# EAGLE design EnhancedMorseDecoder_Board (EAGLE 5.11)
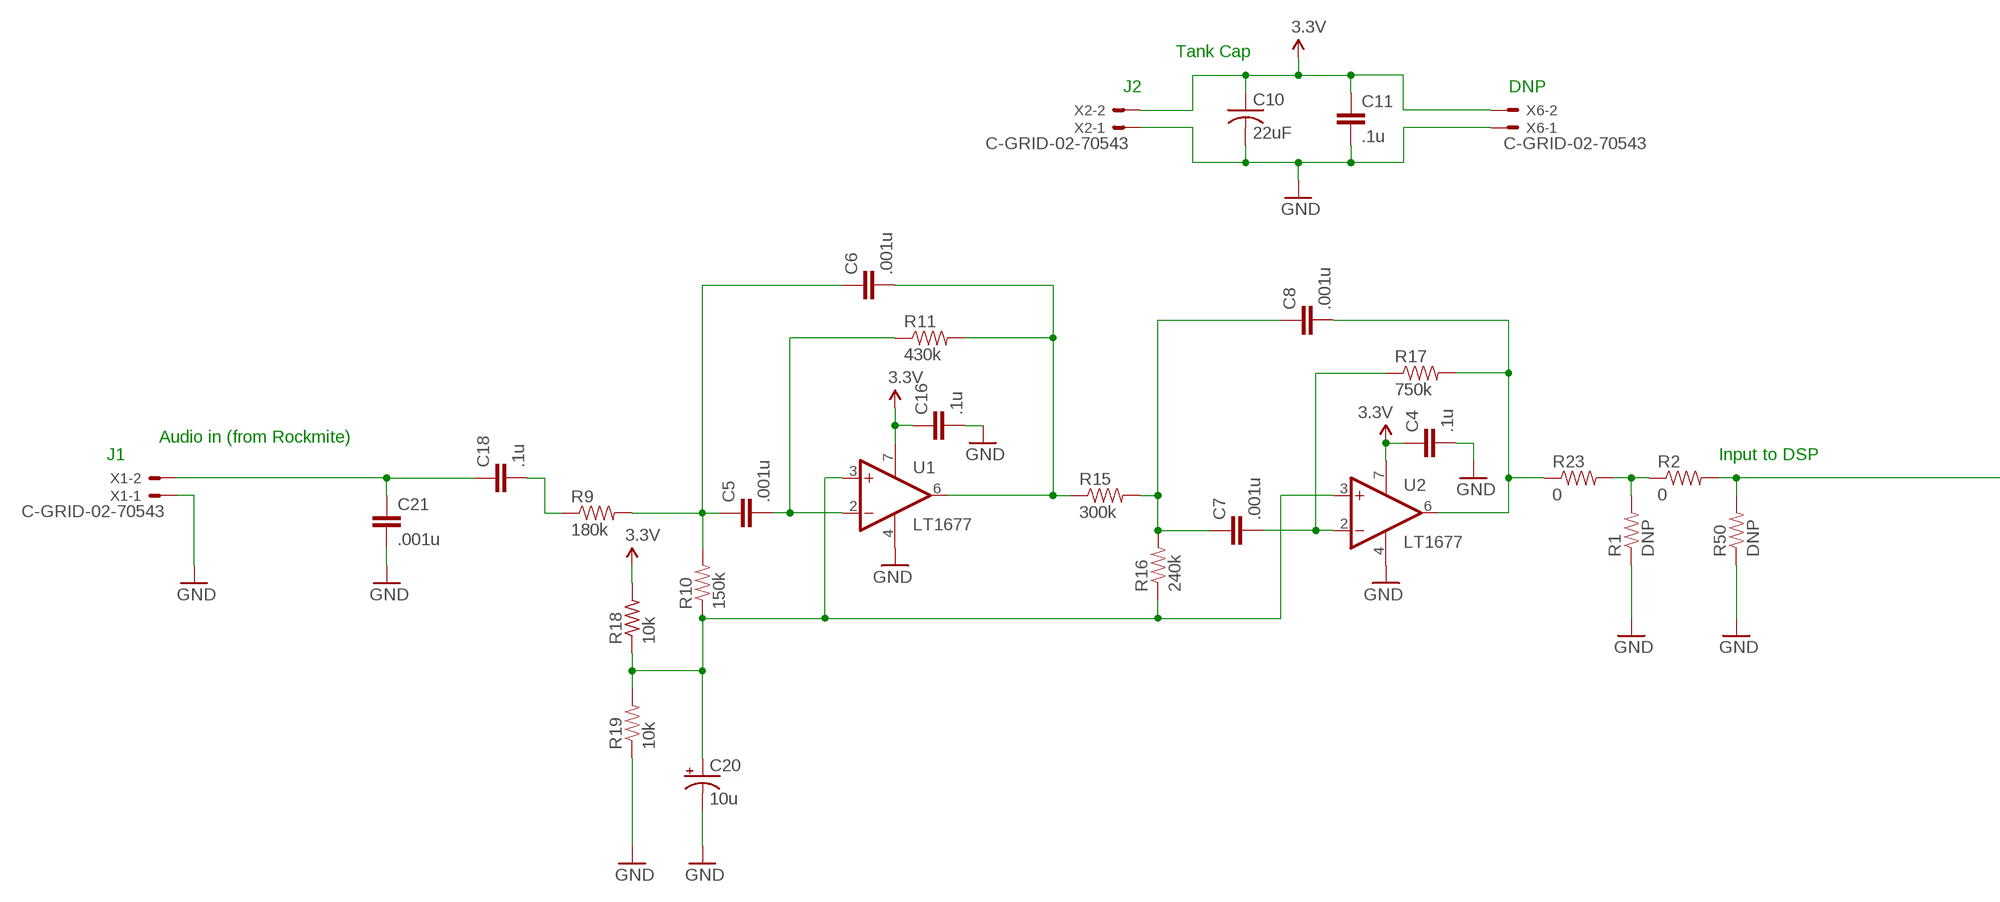
[diagram p0: schematic, sheet 1, part 1 of 2]
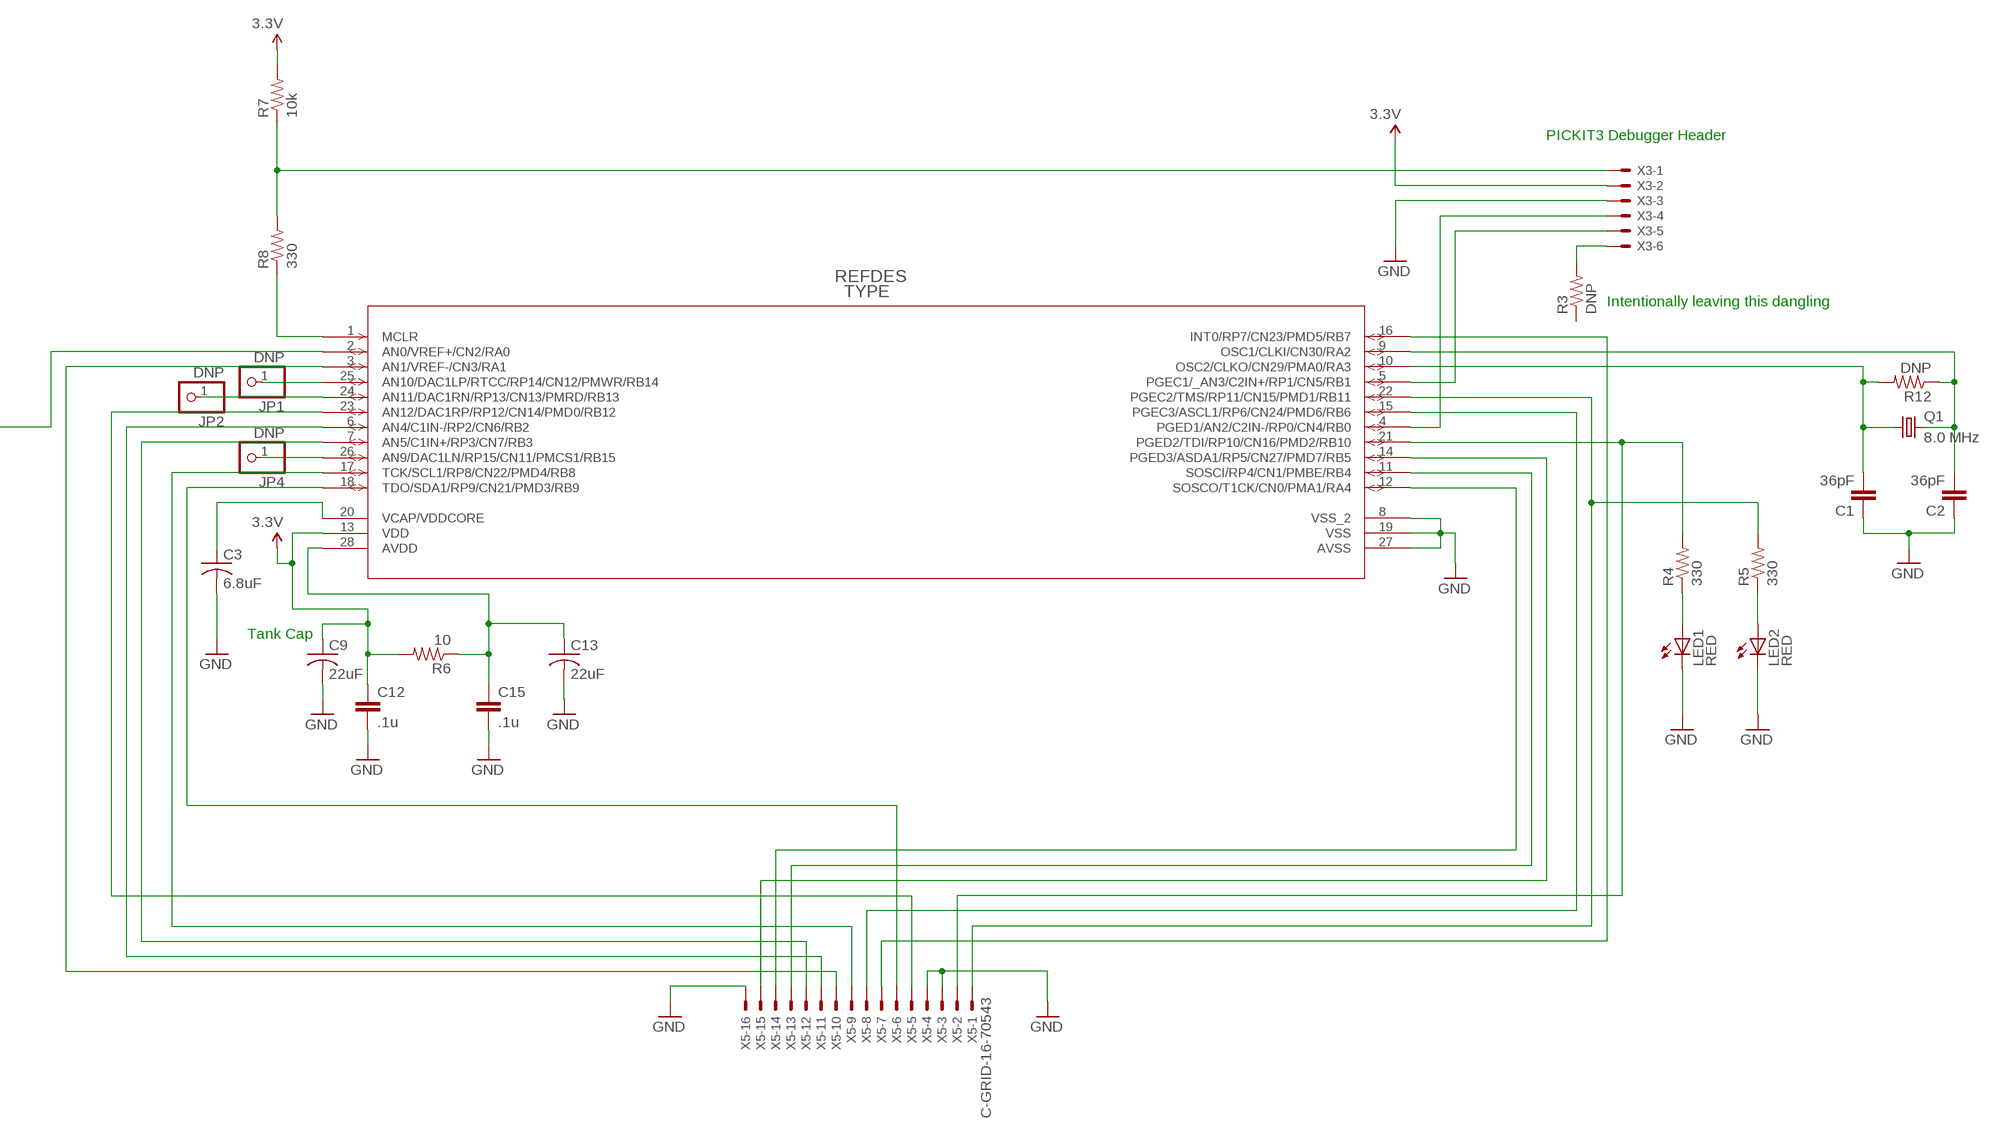
[diagram p1: schematic, sheet 1, part 2 of 2]

## Parts
C1  36pF  CAP0603-CAP  [0603-CAP]
C2  36pF  CAP0603-CAP  [0603-CAP]
C3  6.8uF  C-USC1206  [C1206]
C4  .1u  CAP1210  [1210]
C5  .001u  CAP0805  [0805]
C6  .001u  CAP0805  [0805]
C7  .001u  CAP0805  [0805]
C8  .001u  CAP0805  [0805]
C9  22uF  C-USC1210  [C1210]
C10  22uF  C-USC1210  [C1210]
C11  .1u  CAP1210  [1210]
C12  .1u  CAP1210  [1210]
C13  22uF  C-USC1210  [C1210]
C15  .1u  CAP1210  [1210]
C16  .1u  CAP1210  [1210]
C18  .1u  CAP1210  [1210]
C20  10u  CAP_POL7343  [EIA7343]
C21  .001u  CAP0805  [0805]
DSPIC  DSPIC33FJ128GP80  [SOIC28_W_MC]
JP1  DNP  PINHD-1X1  [1X01]
JP2  DNP  PINHD-1X1  [1X01]
JP4  DNP  PINHD-1X1  [1X01]
LED1  RED  LEDCHIPLED_0805  [CHIPLED_0805]
LED2  RED  LEDCHIPLED_0805  [CHIPLED_0805]
Q1  8.0 MHz  CRYSTALHC49S  [HC49/S]
R1  DNP  RESISTOR  [0805]
R2  0  RESISTOR  [0805]
R3  DNP  RESISTOR  [0805]
R4  330  R-US_R0603  [R0603]
R5  330  R-US_R0603  [R0603]
R6  10  R-US_R0805  [R0805]
R7  10k  R-US_R0603  [R0603]
R8  330  R-US_R0603  [R0603]
R9  180k  RESISTOR  [0805]
R10  150k  RESISTOR1206  [1206]
R11  430k  RESISTOR1206  [1206]
R12  DNP  RESISTOR  [0805]
R15  300k  RESISTOR1206  [1206]
R16  240k  RESISTOR1206  [1206]
R17  750k  RESISTOR1206  [1206]
R18  10k  R-US_R0603  [R0603]
R19  10k  RESISTOR0603-RES  [0603-RES]
R23  0  RESISTOR  [0805]
R50  DNP  RESISTOR  [0805]
U1  LT1677  LM307D  [SO08]
U2  LT1677  LM307D  [SO08]
X1  C-GRID-02-70543  [70543-02]
X2  C-GRID-02-70543  [70543-02]
X3  22-23-2061  [22-23-2061]
X5  C-GRID-16-70543  [70543-16]
X6  C-GRID-02-70543  [70543-02]

## Nets
3.3V: C4.1 C9.1 C10.1 C11.1 C12.1 C16.1 DSPIC.13(VDD) R6.2 R7.2 R18.2 U1.7(V+) U2.7(V+) X2.2 X3.2 X6.2
GND: C1.1 C2.1 C3.2 C4.2 C9.2 C10.2 C11.2 C12.2 C13.2 C15.2 C16.2 C20.C(-) C21.2 DSPIC.8(VSS_2) DSPIC.19(VSS) DSPIC.27(AVSS) LED1.C LED2.C R1.1 R19.1 R50.1 U1.4(V-) U2.4(V-) X1.1 X2.1 X3.3 X5.3 X5.4 X5.16 X6.1
N$1: R1.2 R2.1 R23.2
N$2: C1.2 DSPIC.10(OSC2/CLKO/CN29/PMA0/RA3) Q1.1 R12.2
N$3: C18.2 R9.1
N$4: C5.1 C6.1 R9.2 R10.2
N$5: C20.A(+) R10.1 R16.1 R18.1 R19.2 U1.3(+IN) U2.3(+IN)
N$6: DSPIC.25(AN10/DAC1LP/RTCC/RP14/CN12/PMWR/RB14) JP1.1
N$7: C6.2 R11.2 R15.1 U1.6(OUT)
N$8: C18.1 C21.1 X1.2
N$9: C7.1 C8.1 R15.2 R16.2
N$10: C7.2 R17.1 U2.2(-IN)
N$11: C8.2 R17.2 R23.1 U2.6(OUT)
N$12: C13.1 C15.1 DSPIC.28(AVDD) R6.1
N$13: DSPIC.3(AN1/VREF-/CN3/RA1) X5.10
N$14: DSPIC.2(AN0/VREF+/CN2/RA0) R2.2 R50.2
N$15: C5.2 R11.1 U1.2(-IN)
N$16: DSPIC.4(PGED1/AN2/C2IN-/RP0/CN4/RB0) X3.4
N$17: DSPIC.5(PGEC1/_AN3/C2IN+/RP1/CN5/RB1) X3.5
N$18: R3.2 X3.6
N$19: DSPIC.24(AN11/DAC1RN/RP13/CN13/PMRD/RB13) JP2.1
N$20: DSPIC.23(AN12/DAC1RP/RP12/CN14/PMD0/RB12) X5.5
N$21: DSPIC.26(AN9/DAC1LN/RP15/CN11/PMCS1/RB15) JP4.1
N$22: C2.2 DSPIC.9(OSC1/CLKI/CN30/RA2) Q1.2 R12.1
N$23: DSPIC.21(PGED2/TDI/RP10/CN16/PMD2/RB10) R4.2 X5.2
N$26: DSPIC.17(TCK/SCL1/RP8/CN22/PMD4/RB8) X5.9
N$27: DSPIC.18(TDO/SDA1/RP9/CN21/PMD3/RB9) X5.6
N$28: DSPIC.16(INT0/RP7/CN23/PMD5/RB7) X5.7
N$29: DSPIC.22(PGEC2/TMS/RP11/CN15/PMD1/RB11) R5.2 X5.1
N$30: DSPIC.15(PGEC3/ASCL1/RP6/CN24/PMD6/RB6) X5.8
N$32: DSPIC.14(PGED3/ASDA1/RP5/CN27/PMD7/RB5) X5.15
N$33: DSPIC.11(SOSCI/RP4/CN1/PMBE/RB4) X5.13
N$34: DSPIC.1(MCLR) R8.1
N$35: LED1.A R4.1
N$37: LED2.A R5.1
N$38: DSPIC.12(SOSCO/T1CK/CN0/PMA1/RA4) X5.14
N$39: C3.1 DSPIC.20(VCAP/VDDCORE)
N$40: R7.1 R8.2 X3.1
N$41: DSPIC.6(AN4/C1IN-/RP2/CN6/RB2) X5.11
N$42: DSPIC.7(AN5/C1IN+/RP3/CN7/RB3) X5.12
Unconnected: R3.1

## Notes on the sheet
- Tank Cap
- J2 | DNP
- PICKIT3 Debugger Header
- Intentionally leaving this dangling
- Audio in (from Rockmite)
- J1 | Input to DSP
- Tank Cap

## Library data of the parts
C1 C2 C4-C8 C11 C12 C15 C16 C18 C21 = SparkFun:CAP: Capacitor Standard 0603 ceramic capacitor, and 0.1" leaded capacitor.
C3 C9 C10 C13 = rcl:C-US: CAPACITOR, American symbol
C20 = SparkFun:CAP_POL: Capacitor Polarized These are standard SMD and PTH capacitors. Normally 10uF, 47uF, and 100uF in electrolytic and tantalum varieties. Always verify the external diameter of the through hole cap, it varies with capacity, voltage, and manufacturer. The EIA devices should be standard.
DSPIC = DSPIC33FJ128GPS80:DSPIC33FJ128GP80
JP1 JP2 JP4 = pinhead:PINHD-1X1: PIN HEADER
LED1 LED2 = led:LED: LED OSRAM: - CHIPLED LG R971, LG N971, LY N971, LG Q971, LY Q971, LO R971, LY R971 LH N974, LH R974 LS Q976, LO Q976, LY Q976 LO Q996 - Hyper CHIPLED LW Q18S LB Q993, LB Q99A, LB R99A - SideLED LS A670, LO A670, LY A670, LG A670, LP A670 LB A673, LV A673, LT A673, LW A673 LH A674 LY A675 LS A676, LA A676, LO A676, LY A676, LW A676 LS A679, LY A679, LG A679 - Hyper Micro SIDELED® LS Y876, LA Y876, LO Y876, LY Y876 LT Y87S - SmartLED LW L88C, LW L88S LB L89C, LB L89S, LG L890 LS L89K, LO L89K, LY L89K LS L896, LA L896, LO L896, LY L896 - TOPLED LS T670, LO T670, LY T670, LG T670, LP T670 LSG T670, LSP T670, LSY T670, LOP T670, LYG T670 LG T671, LOG T671, LSG T671 LB T673, LV T673, LT T673, LW T673 LH T674 LS T676, LA T676, LO T676, LY T676, LB T676, LH T676, LSB T676, LW T676 LB T67C, LV T67C, LT T67C, LS T67K, LO T67K, LY T67K, LW E67C LS E67B, LA E67B, LO E67B, LY E67B, LB E67C, LV E67C, LT E67C LW T67C LS T679, LY T679, LG T679 LS T770, LO T770, LY T770, LG T770, LP T770 LB T773, LV T773, LT T773, LW T773 LH T774 LS E675, LA E675, LY E675, LS T675 LS T776, LA T776, LO T776, LY T776, LB T776 LHGB T686 LT T68C, LB T68C - Hyper Mini TOPLED® LB M676 - Mini TOPLED Santana® LG M470 LS M47K, LO M47K, LY M47K Source: http://www.osram.convergy.de LUXEON: - LUMILED® LXK2-PW12-R00, LXK2-PW12-S00, LXK2-PW14-U00, LXK2-PW14-V00 LXK2-PM12-R00, LXK2-PM12-S00, LXK2-PM14-U00 LXK2-PE12-Q00, LXK2-PE12-R00, LXK2-PE12-S00, LXK2-PE14-T00, LXK2-PE14-U00 LXK2-PB12-K00, LXK2-PB12-L00, LXK2-PB12-M00, LXK2-PB14-N00, LXK2-PB14-P00, LXK2-PB14-Q00 LXK2-PR12-L00, LXK2-PR12-M00, LXK2-PR14-Q00, LXK2-PR14-R00 LXK2-PD12-Q00, LXK2-PD12-R00, LXK2-PD12-S00 LXK2-PH12-R00, LXK2-PH12-S00 LXK2-PL12-P00, LXK2-PL12-Q00, LXK2-PL12-R00 Source: www.luxeon.com KINGBRIGHT: KA-3528ASYC Source: www.kingbright.com
Q1 = crystal:CRYSTAL: CRYSTAL; OC_FARNELL: 1667008; OC_NEWARK: unknown
R1-R3 R9-R12 R15-R17 R19 R23 R50 = SparkFun:RESISTOR: Resistor Basic schematic elements and footprints for 0603, 1206, and PTH 1/10th watt (small) resistors.
R4-R8 R18 = rcl:R-US_: RESISTOR, American symbol
U1 U2 = linear:LM307: OP AMP
X1 X2 X6 = con-molex:C-GRID-02: CONNECTOR wire to board 2.54 mm (0.100") pitch header; OC_FARNELL: unknown; OC_NEWARK: unknown
X3 = con-molex:22-23-2061: .100" (2.54mm) Center Header - 6 Pin; MF: MOLEX; MPN: 22-23-2061; OC_FARNELL: 1462922; OC_NEWARK: 27C1933
X5 = con-molex:C-GRID-16: CONNECTOR wire to board 2.54 mm (0.100") pitch header; OC_FARNELL: unknown; OC_NEWARK: unknown

## Board
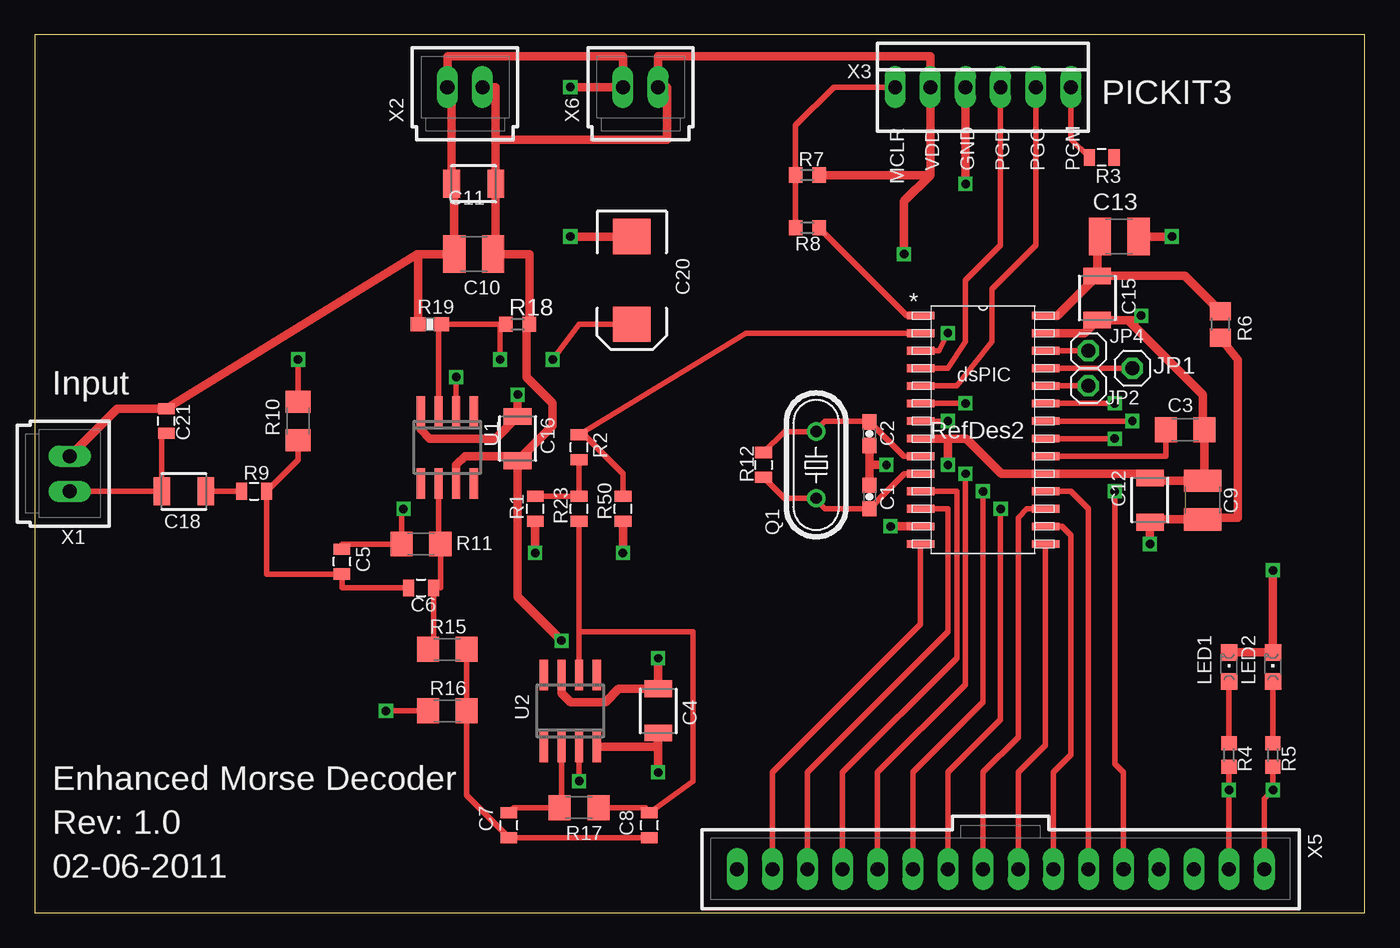
[diagram p2: board, top side]
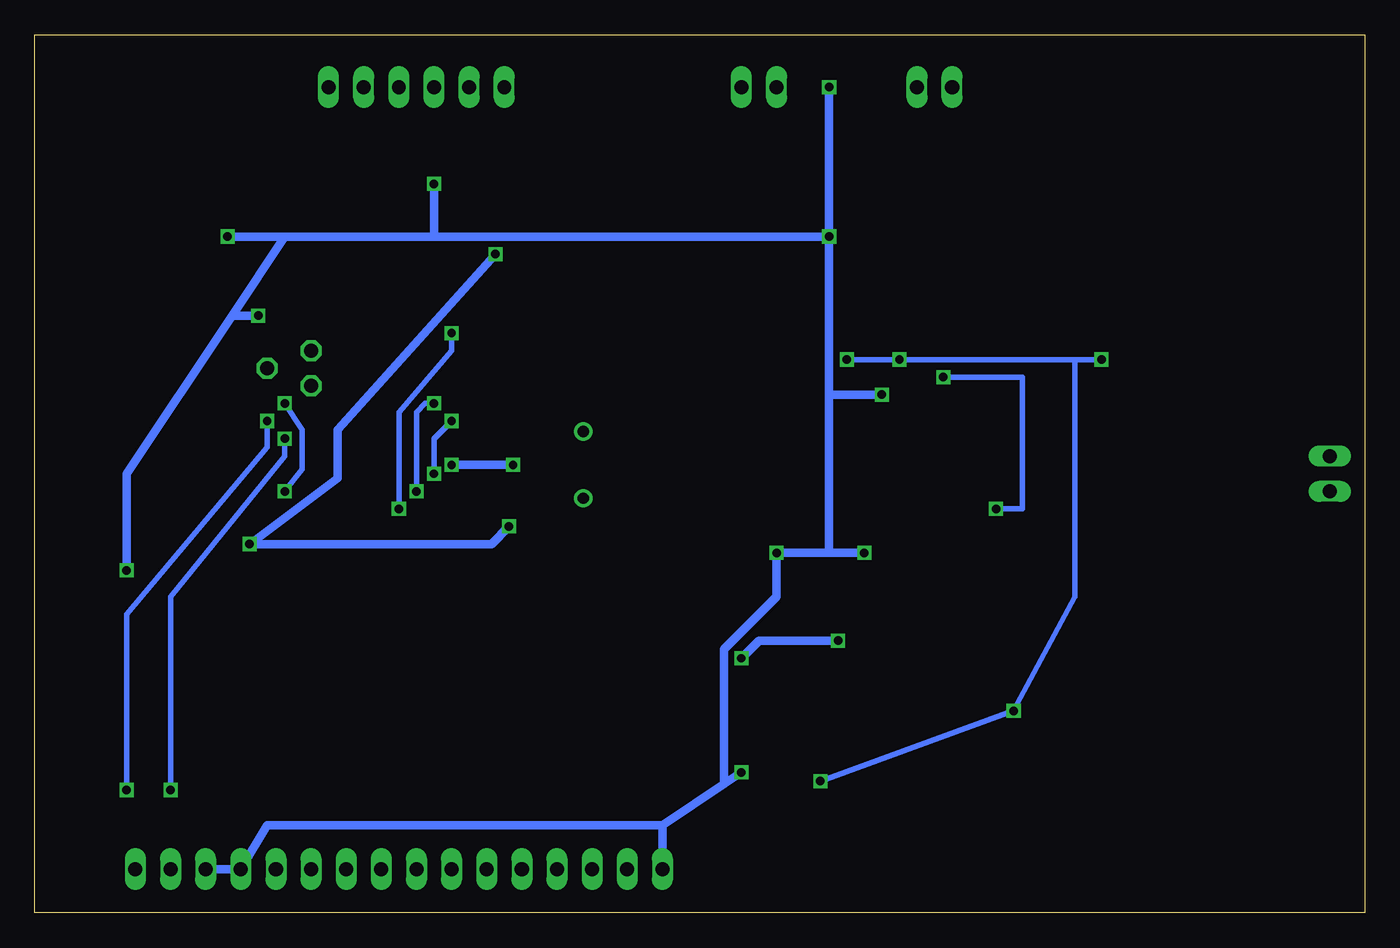
[diagram p3: board, bottom side, seen from below]

Size 96.19 x 63.49 mm. Coordinates in mm from the lower left corner, seen from the top.
Outline: 0,0 96.19,0 96.19,63.49 0,63.49 0,0
Copper layers (1*16): Top 0.035mm / dielectric 1.5mm / Bottom 0.035mm
Design rules "default": minimum track width 10mil, minimum drill 24mil, track to track 8mil, track to pad 8mil, pad to pad 8mil, via to via 8mil, smd to smd 8mil, copper to edge 40mil, drill to drill 8mil, minimum pad ring 10mil, minimum via ring 8mil, stop-mask expansion 4mil, vias tented up to drill 0mil, thermal gap 10mil

### Footprints (pad centres in the part's own frame; a part is rotated, then mirrored left to right if it is on the bottom)
0603-CAP = smd 1.1 x 1: 1 -0.85,0; 2 0.85,0
C1206 = smd 1.6 x 1.8: 1 -1.4,0; 2 1.4,0
1210 = smd 1.2 x 2: 1 -1.6,0; 2 1.6,0
0805 = smd 0.8 x 1.2: 1 -0.9,0; 2 0.9,0
C1210 = smd 1.6 x 2.7: 1 -1.4,0; 2 1.4,0
EIA7343 = smd 2.55 x 2.7: A 3.17,0; C -3.17,0
SOIC28_W_MC = smd 1.981 x 0.559: 1 -4.521,8.255; 2 -4.521,6.985; 3 -4.521,5.715; 4 -4.521,4.445; 5 -4.521,3.175; 6 -4.521,1.905; 7 -4.521,0.635; 8 -4.521,-0.635; 9 -4.521,-1.905; 10 -4.521,-3.175; 11 -4.521,-4.445; 12 -4.521,-5.715; 13 -4.521,-6.985; 14 -4.521,-8.255; 15 4.521,-8.255; 16 4.521,-6.985; 17 4.521,-5.715; 18 4.521,-4.445; 19 4.521,-3.175; 20 4.521,-1.905; 21 4.521,-0.635; 22 4.521,0.635; 23 4.521,1.905; 24 4.521,3.175; 25 4.521,4.445; 26 4.521,5.715; 27 4.521,6.985; 28 4.521,8.255
1X01 = drill 1.016 octagon: 1 0,0
CHIPLED_0805 = smd 1.2 x 1.2: A 0,-1.05; C 0,1.05
HC49/S = drill 0.813 round: 1 -2.413,0; 2 2.413,0
R0603 = smd 1 x 1.1: 1 -0.85,0; 2 0.85,0
R0805 = smd 1.3 x 1.5: 1 -0.95,0; 2 0.95,0
1206 = smd 1.6 x 1.8: 1 -1.4,0; 2 1.4,0
0603-RES = smd 1.1 x 1: 1 -0.85,0; 2 0.85,0
SO08 = smd 0.6 x 2.2: 1 -1.905,-2.6; 2 -0.635,-2.6; 3 0.635,-2.6; 4 1.905,-2.6; 5 1.905,2.6; 6 0.635,2.6; 7 -0.635,2.6; 8 -1.905,2.6
70543-02 = drill 1.016 long: 1 -1.27,0; 2 1.27,0
22-23-2061 = drill 1 long: 1 -6.35,0; 2 -3.81,0; 3 -1.27,0; 4 1.27,0; 5 3.81,0; 6 6.35,0
70543-16 = drill 1.016 long: 1 -19.05,0; 2 -16.51,0; 3 -13.97,0; 4 -11.43,0; 5 -8.89,0; 6 -6.35,0; 7 -3.81,0; 8 -1.27,0; 9 1.27,0; 10 3.81,0; 11 6.35,0; 12 8.89,0; 13 11.43,0; 14 13.97,0; 15 16.51,0; 16 19.05,0

### Placement (x,y rotation side)
C1  60.38,30.07 270 top
C2  60.38,34.65 90 top
C3  83.19,34.92 0 top
C4  45.09,14.61 270 top
C5  22.23,25.4 90 top
C6  27.94,23.5 0 top
C7  34.29,6.35 90 top
C8  44.45,6.35 90 top
C9  84.45,29.84 90 top
C10  31.75,47.62 180 top
C11  31.75,52.7 180 top
C12  80.64,29.84 90 top
C13  78.42,48.9 0 top
C15  76.83,44.45 270 top
C16  34.92,34.29 90 top
C18  10.79,30.48 0 top
C20  43.18,45.72 270 top
C21  9.53,35.56 90 top
DSPIC  68.58,34.92 0 top
JP1  79.38,39.37 0 top
JP2  76.2,38.1 0 top
JP4  76.2,40.64 0 top
LED1  86.36,17.78 0 top
LED2  89.53,17.78 0 top
Q1  56.52,32.38 90 top
R1  36.2,29.21 90 top
R2  39.37,33.66 90 top
R3  77.15,54.61 180 top
R4  86.36,11.43 270 top
R5  89.53,11.43 270 top
R6  85.72,42.55 270 top
R7  55.88,53.34 0 top
R8  55.88,49.53 180 top
R9  15.88,30.48 0 top
R10  19.05,35.56 270 top
R11  27.94,26.67 0 top
R12  52.7,32.38 270 top
R15  29.84,19.05 0 top
R16  29.84,14.61 0 top
R17  39.37,7.62 0 top
R18  34.92,42.55 0 top
R19  28.57,42.55 0 top
R23  39.37,29.21 90 top
R50  42.55,29.21 90 top
U1  29.84,33.66 180 top
U2  38.73,14.61 0 top
X1  2.54,31.75 270 top
X2  31.11,59.69 0 top
X3  68.58,59.69 0 top
X5  69.85,3.17 180 top
X6  43.81,59.69 0 top

### Tracks (layer width: path | path; a pad name or v marks a point on that pad's centre or on a via)
3.3V  (via drill 0.61)
  Top 0.406: 33.35,47.62 C10.1 | C9.1 83.82,28.57 | C12.1 80.64,28.45 | 35.56,42.55 R18.2
  Top 0.61: X2.2 33.35,59.69 33.35,55.88 | 33.35,55.88 C11.1 33.35,47.62 35.77,47.62 R18.2 | 33.35,55.88 45.72,55.88 45.72,59.69 X6.2 45.09,61.91 64.77,61.91 X3.2 64.77,53.34 | 83.82,28.57 87,28.57 87,40.01 R6.2 | 80.64,28.45 C9.1 | v80.64,26.67 C12.1 | 64.77,53.34 R7.2 | 35.56,42.55 35.56,38.73 37.47,36.83 37.47,35.23 C16.1 | v61.89,27.94 DSPIC.13 | 64.77,53.34 62.87,51.44 v62.87,47.62 | U1.7 30.48,32.38 31.11,33.02 34.92,33.02 C16.1 | C16.1 34.92,22.86 v38.1,19.68 | v45.09,18.41 C4.1 42.24,16.2 41.27,15.24 38.73,15.24 38.1,15.88 U2.7
  Bottom 0.61: v62.87,47.62 74.3,34.92 74.3,31.43 v80.64,26.67 63.16,26.67 v61.89,27.94 | v38.1,19.68 43.81,19.68 v45.09,18.41
GND  (via drill 0.61)
  Top 0.406: 30.15,59.69 X2.1 | 30.35,52.7 C11.2 | 80.64,31.25 C12.2 80.36,31.75 | 27.68,47.62 C10.2 | C20.C | C4.2 45.09,12.01 | 84.45,35.05 C3.2 | 84.58,31.38 C9.2
  Top 0.61: X2.1 29.84,61.91 42.55,61.91 X6.1 v38.73,59.69 | C11.2 30.15,59.69 | 30.35,52.7 C10.2 27.73,47.62 R19.1 | C9.2 80.64,31.25 | 80.36,31.75 DSPIC.19 69.9,31.75 67.36,34.29 66.04,34.29 | X1.1 5.98,36.46 C21.2 27.68,47.62 | v38.73,48.9 C20.C | 45.09,12.01 U2.4 | v42.55,26.04 R50.1 | v45.09,10.16 C4.2 | 66.04,34.29 DSPIC.8 | U1.4 27.94,34.92 28.57,34.29 33.33,34.29 C16.2 v34.92,37.47 | v36.2,26.04 R1.1 | LED1.C LED2.C v89.53,24.77 | v67.31,52.7 X3.3 | v80.01,43.18 79.68,42.85 C15.2 | C15.2 75.89,41.91 DSPIC.27 | C1.1 C2.1 60.38,32.38 v61.59,32.38 | 66.04,34.29 v66.04,32.38 | C15.2 79.07,42.85 84.45,37.47 84.45,35.05 | C3.2 84.58,31.38 | v82.23,48.9 C13.2
  Bottom 0.406: 46.35,9.48 46.26,9.38
  Bottom 0.61: v38.73,59.69 v38.73,48.9 | v45.09,10.16 46.26,9.38 50.8,6.35 | 50.8,6.35 X5.16 | 38.73,26.04 v42.55,26.04 42.55,22.86 46.35,19.05 46.35,9.48 | 38.73,26.04 v36.2,26.04 | v38.73,48.9 38.73,37.47 | 38.73,37.47 38.73,26.04 | 38.73,37.47 v34.92,37.47 | v38.73,48.9 67.31,48.9 | 67.31,48.9 v67.31,52.7 | 67.31,48.9 78.11,48.9 | 78.11,48.9 81.92,43.18 | 81.92,43.18 89.53,31.75 v89.53,24.77 | 81.92,43.18 v80.01,43.18 | v66.04,32.38 v61.59,32.38 | X5.3 X5.4 79.38,6.35 50.8,6.35 | 78.11,48.9 v82.23,48.9
N$1
  Top 0.406: R1.2 R23.2 R2.1
N$2
  Top 0.406: R12.2 54.22,29.97 Q1.1 56.52,29.84 57.15,29.21 60.36,29.21 C1.2 62.9,31.75 DSPIC.10
N$3
  Top 0.406: C18.2 R9.1
N$4
  Top 0.406: C6.1 22.23,23.5 C5.1 16.77,24.5 R9.2 19.05,32.76 R10.2
N$5  (via drill 0.61)
  Top 0.406: U1.3 29.21,42.55 R19.2 R18.1 33.66,42.55 v33.66,40.01 | v37.47,40.01 39.37,42.55 C20.A | v19.05,40.01 R10.1 | v39.37,9.53 U2.3 | v25.4,14.61 R16.1
  Bottom 0.406: v37.47,40.01 v33.66,40.01 20.95,40.01 | 20.95,40.01 v19.05,40.01 | 20.95,40.01 20.95,22.86 v25.4,14.61 v39.37,9.53
N$6
  Top 0.406: DSPIC.25 JP1.1
N$7
  Top 0.406: R15.1 28.84,19.45 C6.2 29.34,23.5 R11.2 29.21,26.8 U1.6
N$8
  Top 0.406: X1.2 C18.1 9.2,34.33 C21.1
N$9
  Top 0.406: R15.2 R16.2 31.25,8.49 C7.1 C8.1
N$10
  Top 0.406: R17.1 37.97,7.25 | R17.1 38.1,7.12 U2.2 | C7.2 34.66,7.62 R17.1
N$11
  Top 0.406: 39.37,20.32 47.62,20.32 47.62,9.53 C8.2 44.19,7.62 R17.2 | 39.37,20.32 U2.6 | 39.37,20.32 R23.1
N$12
  Top 0.406: 76.83,48.71 C13.1
  Top 0.61: C15.1 73.97,43.18 DSPIC.28 | C15.1 83.17,46.05 R6.1 | C15.1 76.83,48.71
N$13  (via drill 0.61)
  Top 0.406: DSPIC.3 65.41,40.64 v66.04,41.91 | X5.10 66.04,10.16 69.85,13.97 v69.85,29.21
  Bottom 0.406: v66.04,41.91 66.04,40.64 69.85,36.2 v69.85,29.21
N$14
  Top 0.406: DSPIC.2 51.44,41.91 R2.2 39.74,34.55 42.55,31.75 R50.2
N$15  (via drill 0.61)
  Top 0.406: C5.2 22.23,26.67 R11.1 26.54,29.21 v26.67,29.21 | v30.48,38.73 U1.2
  Bottom 0.406: v30.48,38.73 24.77,38.73 24.77,29.21 v26.67,29.21
N$16
  Top 0.406: DSPIC.4 66.04,39.37 67.31,41.27 67.31,45.72 69.85,48.26 X3.4
N$17
  Top 0.406: DSPIC.5 66.67,38.1 69.22,41.27 69.22,45.09 72.39,48.26 X3.5
N$18
  Top 0.406: X3.6 74.93,55.93 R3.2
N$19
  Top 0.406: DSPIC.24 JP2.1
N$20  (via drill 0.61)
  Top 0.406: v78.11,36.83 DSPIC.23 | v78.11,30.48 78.11,10.79 78.74,10.16 X5.5
  Bottom 0.406: v78.11,30.48 76.83,32.07 76.83,34.92 v78.11,36.83
N$21
  Top 0.406: DSPIC.26 JP4.1
N$22
  Top 0.406: R12.1 54.22,34.8 Q1.2 56.52,34.92 57.15,35.56 60.31,35.56 C2.2 62.85,33.02 DSPIC.9
N$23  (via drill 0.61)
  Top 0.406: X5.2 v86.36,8.89 R4.2 | v78.11,34.29 DSPIC.21
  Bottom 0.406: v78.11,34.29 78.11,33.02 86.36,22.86 v86.36,8.89
N$26
  Top 0.406: DSPIC.17 71.75,29.21 71.12,28.57 71.12,12.7 68.58,10.16 X5.9
N$27
  Top 0.406: X5.6 76.2,29.21 74.93,30.48 DSPIC.18
N$28
  Top 0.406: DSPIC.16 74.3,27.94 74.93,27.3 74.93,11.43 73.66,10.16 X5.7
N$29  (via drill 0.61)
  Top 0.406: v79.38,35.56 DSPIC.22 | R5.2 v89.53,8.89 88.9,8.26 X5.1
  Bottom 0.406: v89.53,8.89 89.53,21.59 79.38,33.66 v79.38,35.56
N$30
  Top 0.406: DSPIC.15 73.1,12.14 71.12,10.16 X5.8
N$32
  Top 0.406: DSPIC.14 64.06,20.88 53.34,10.16 X5.15
N$33
  Top 0.406: DSPIC.11 66.67,30.48 66.67,18.41 58.42,10.16 X5.13
N$34
  Top 0.406: DSPIC.1 63.08,43.18 R8.1
N$35
  Top 0.406: R4.1 LED1.A
N$37
  Top 0.406: R5.1 LED2.A
N$38
  Top 0.406: X5.14 55.88,10.16 66.04,20.32 66.04,29.21 DSPIC.12
N$39
  Top 0.406: DSPIC.20 81.78,33.02 C3.1
N$40
  Top 0.406: R8.2 R7.1 55.03,56.94 57.78,59.69 X3.1
N$41  (via drill 0.61)
  Top 0.406: v67.31,36.83 DSPIC.6 | v68.58,30.48 68.58,15.24 63.5,10.16 X5.11
  Bottom 0.406: v67.31,36.83 67.94,36.83 68.58,36.2 v68.58,30.48
N$42  (via drill 0.61)
  Top 0.406: X5.12 60.96,10.16 67.31,16.51 v67.31,31.75 | v66.04,35.56 DSPIC.7
  Bottom 0.406: v66.04,35.56 67.31,34.29 v67.31,31.75

### Text on the board
tPlace: PICKIT3 | VDD | GND | PGD | PGC | PGM | MCLR | dsPIC | Input | Enhanced Morse Decoder | Rev: 1.0 | 02-06-2011